# EasyEDA Pro project PID LFR.eprj

# Schematic PCB_SCHEMATIC
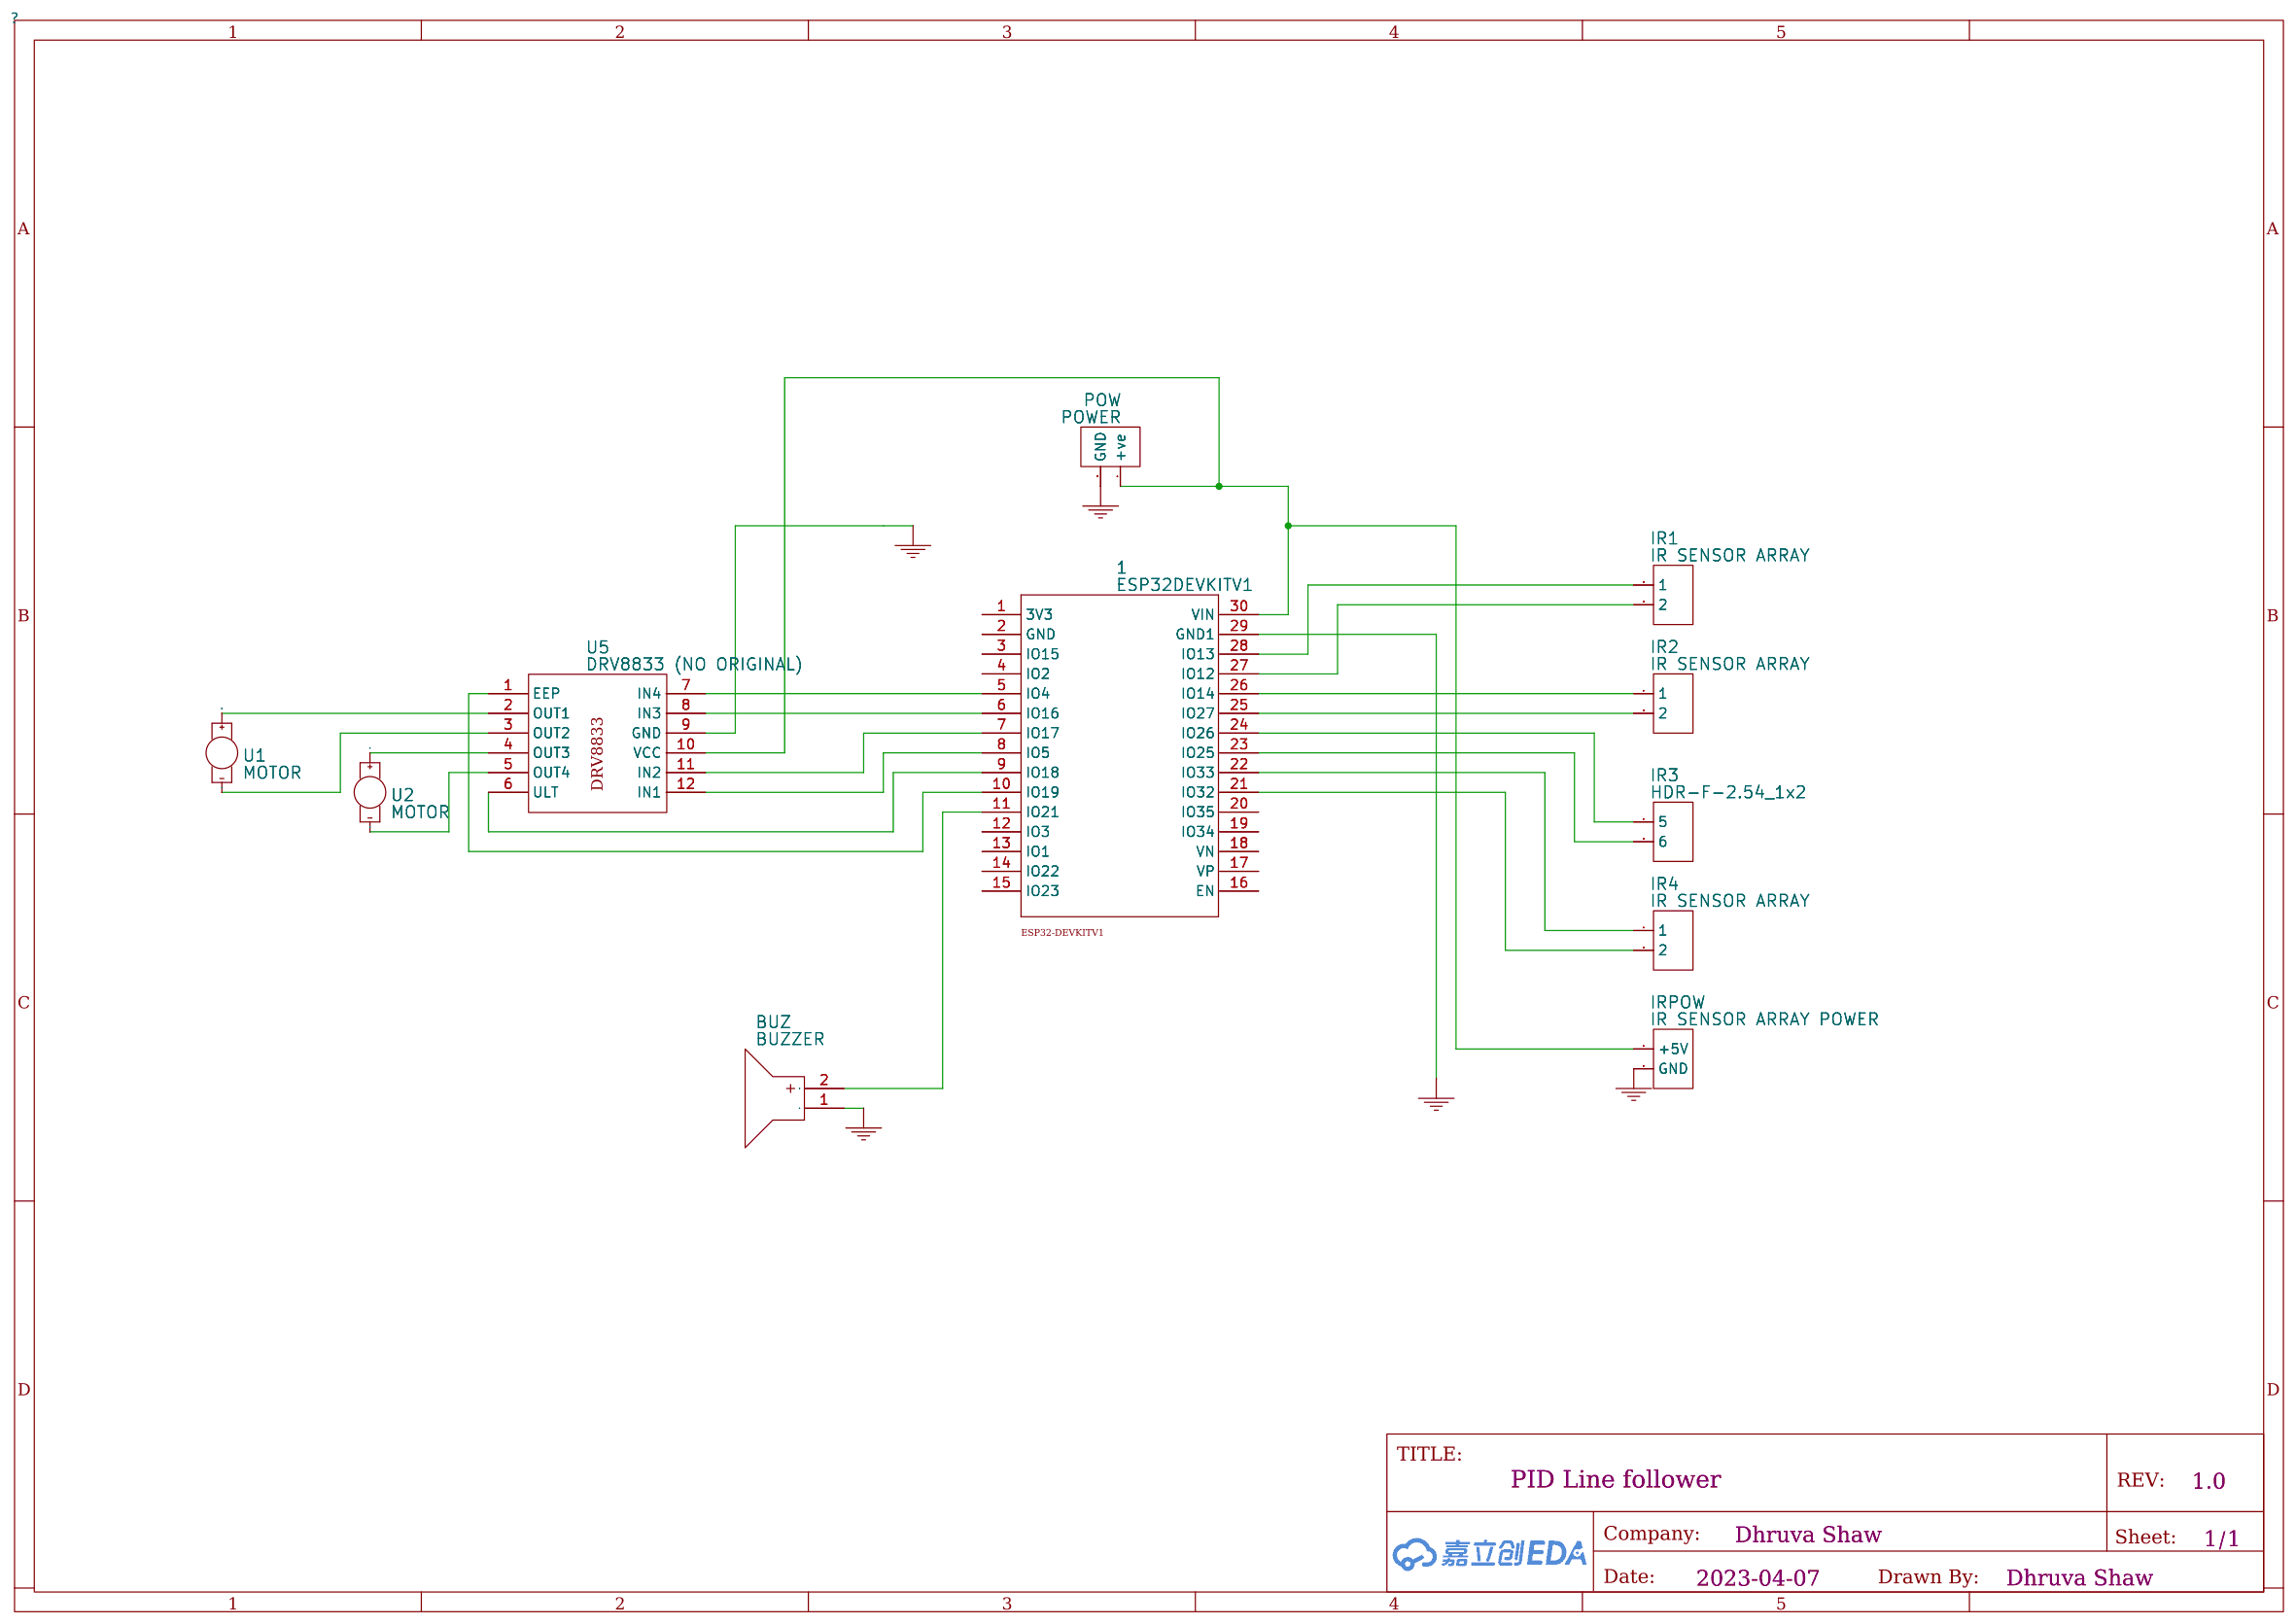
[diagram p0: schematic sheet]

## Parts
1  ESP32DEVKITV1  [ESP32-DEVKITV1]
BUZ  BUZZER  [BUZ-TH_BD12.0-P6.00-D0.9-RD]
IR1  IR SENSOR ARRAY  [HDR-F-2.54_1X2]
IR2  IR SENSOR ARRAY  [HDR-F-2.54_1X2]
IR3  HDR-F-2.54_1x2  [HDR-F-2.54_1X2]
IR4  IR SENSOR ARRAY  [HDR-F-2.54_1X2]
IRPOW  IR SENSOR ARRAY POWER  [HDR-F-2.54_1X2]
POW  POWER  [HDR-F-2.54_1X2]
U1  MOTOR  [VIBE-MOTOR-10MM]
U2  MOTOR  [VIBE-MOTOR-10MM]
U5  DRV8833 (NO ORIGINAL)  [DRV8833 (NO ORIGINAL)]

## Library data of the parts
1 = ESP32DEVKITV1: Supplier: Digi-Key
BUZ = BUZZER: link: https://img.jlc.com/image//data/smt-stock-produce/componentSizePhoto/2022-04-13/30ef8086992546a4800433e601a3dd17/BG2204110731_D22040900139_font.png; Supplier: LCSC; Supplier Part: C9900014030; Manufacturer: null; Manufacturer Part: buzzer; JLCPCB Part Class: Extended Part
IR1 IR2 IR4 = IR SENSOR ARRAY: 3DModel: HDR-F-2.54_1x2; Supplier Part: C49661; Supplier: LCSC
IR3 = HDR-F-2.54_1x2: Supplier Part: C49661; Supplier: LCSC
IRPOW = IR SENSOR ARRAY POWER: 3DModel: HDR-F-2.54_1x2; Supplier Part: C49661; Supplier: LCSC
POW = POWER: 3DModel: HDR-F-2.54_1x2; Supplier Part: C49661; Supplier: LCSC
U1 U2 = MOTOR
U5 = DRV8833 (NO ORIGINAL)

## Nets
GND: 1.29(GND1) BUZ.1(-) IRPOW.2(GND) POW.2(GND) U5.9(GND)
1_5: 1.5(IO4) U5.7(IN4)
1_6: 1.6(IO16) U5.8(IN3)
1_7: 1.7(IO17) U5.11(IN2)
1_8: 1.8(IO5) U5.12(IN1)
1_9: 1.9(IO18) U5.6(ULT)
1_10: 1.10(IO19) U5.1(EEP)
1_11: 1.11(IO21) BUZ.2(+)
1_21: 1.21(IO32) IR4.2(8)
1_22: 1.22(IO33) IR4.1(7)
1_23: 1.23(IO25) IR3.2(6)
1_24: 1.24(IO26) IR3.1(5)
1_25: 1.25(IO27) IR2.2(4)
1_26: 1.26(IO14) IR2.1(3)
1_27: 1.27(IO12) IR1.2
1_28: 1.28(IO13) IR1.1
1_30: 1.30(VIN) IRPOW.1(+5V) POW.1(+ve) U5.10(VCC)
Net-(U1-+): U1.+ U5.2(OUT1)
Net-(U1--): U1.- U5.3(OUT2)
Net-(U2-+): U2.+ U5.4(OUT3)
Net-(U2--): U2.- U5.5(OUT4)

Not connected (* = marked no-connect by the designer): 1 1(3V3) 2(GND) 3(IO15) 4(IO2) 12(IO3) 13(IO1) 14(IO22) 15(IO23) 16(EN) 17(VP) 18(VN) 19(IO34) 20(IO35)

# Schematic ORIGINAL_SCHEMATIC
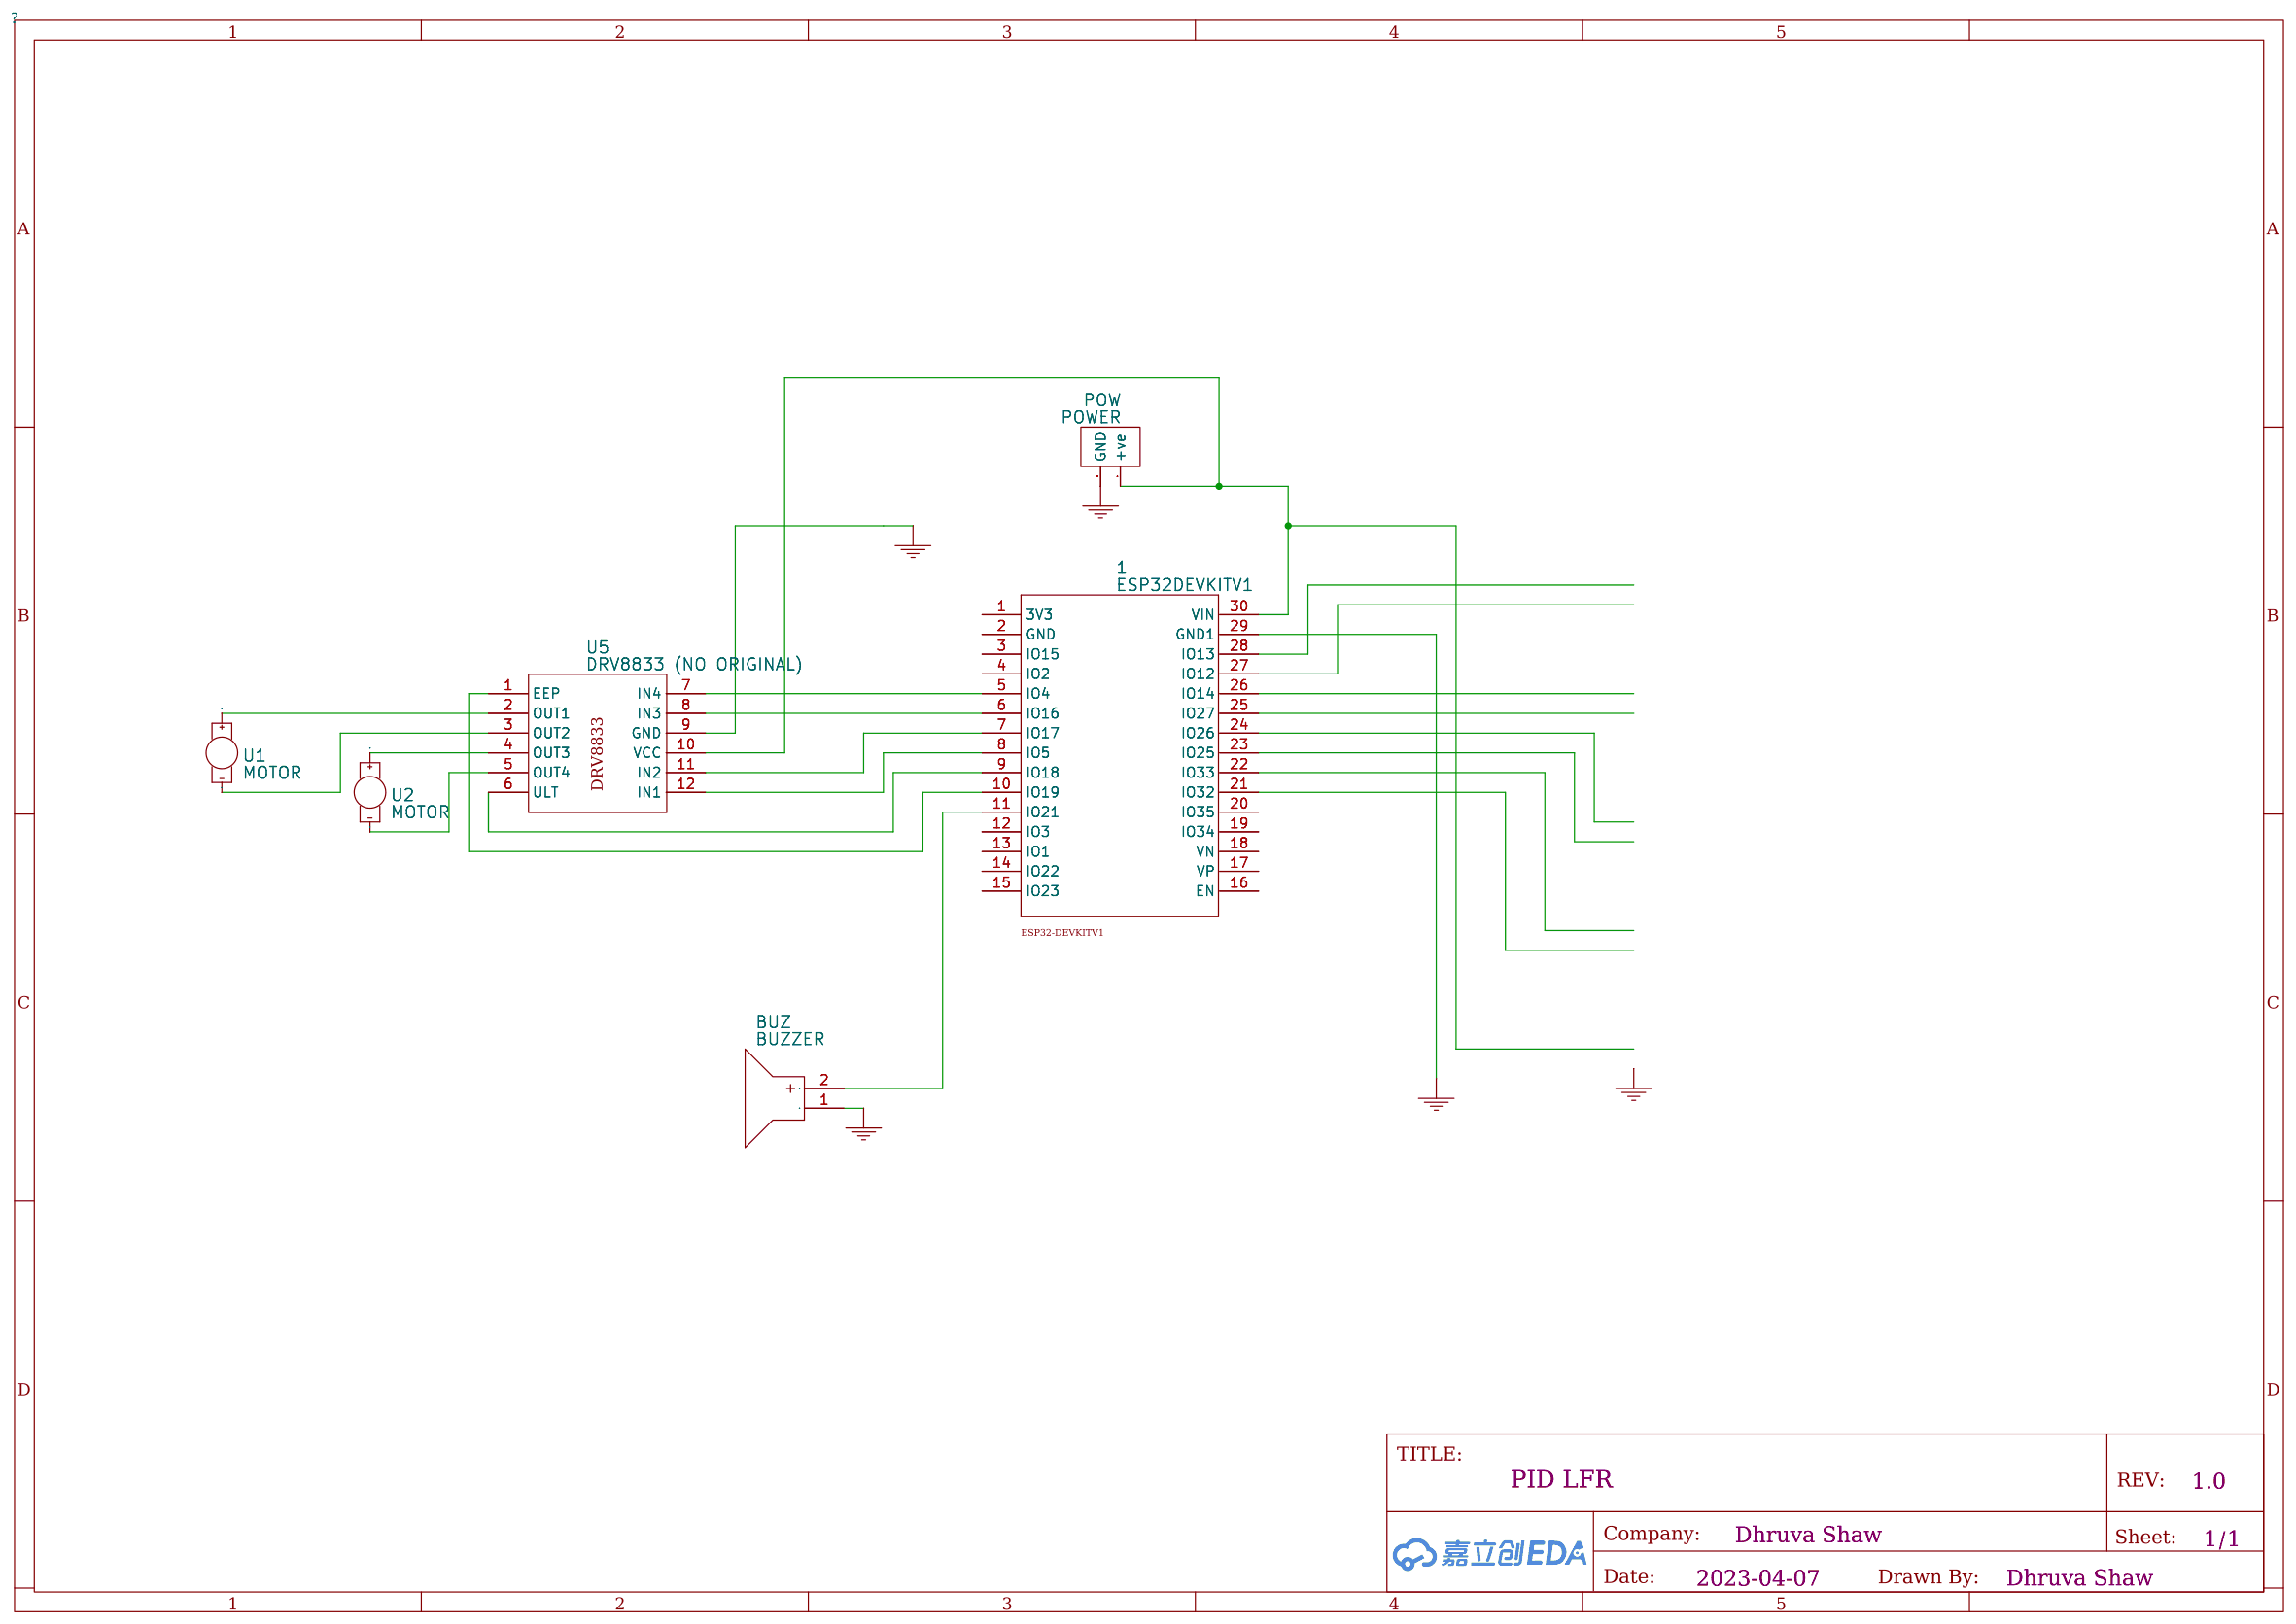
[diagram p1: schematic sheet]

## Parts
1  ESP32DEVKITV1  [ESP32-DEVKITV1]
BUZ  BUZZER  [BUZ-TH_BD12.0-P6.00-D0.9-RD]
POW  POWER  [HDR-F-2.54_1X2]
U1  MOTOR  [VIBE-MOTOR-10MM]
U2  MOTOR  [VIBE-MOTOR-10MM]
U5  DRV8833 (NO ORIGINAL)  [DRV8833 (NO ORIGINAL)]

## Library data of the parts
1 = ESP32DEVKITV1: Supplier: Digi-Key
BUZ = BUZZER: link: https://img.jlc.com/image//data/smt-stock-produce/componentSizePhoto/2022-04-13/30ef8086992546a4800433e601a3dd17/BG2204110731_D22040900139_font.png; Supplier: LCSC; Supplier Part: C9900014030; Manufacturer: null; Manufacturer Part: buzzer; JLCPCB Part Class: Extended Part
POW = POWER: 3DModel: HDR-F-2.54_1x2; Supplier Part: C49661; Supplier: LCSC
U1 U2 = MOTOR
U5 = DRV8833 (NO ORIGINAL)

## Nets
GND: 1.29(GND1) BUZ.1(-) POW.2(GND) U5.9(GND)
Net-(1-5): 1.5(IO4) U5.7(IN4)
Net-(1-6): 1.6(IO16) U5.8(IN3)
Net-(1-7): 1.7(IO17) U5.11(IN2)
Net-(1-8): 1.8(IO5) U5.12(IN1)
Net-(1-9): 1.9(IO18) U5.6(ULT)
Net-(1-10): 1.10(IO19) U5.1(EEP)
Net-(1-11): 1.11(IO21) BUZ.2(+)
Net-(1-30): 1.30(VIN) POW.1(+ve) U5.10(VCC)
Net-(U1-+): U1.+ U5.2(OUT1)
Net-(U1--): U1.- U5.3(OUT2)
Net-(U2-+): U2.+ U5.4(OUT3)
Net-(U2--): U2.- U5.5(OUT4)

Not connected (* = marked no-connect by the designer): 1 1(3V3) 2(GND) 3(IO15) 4(IO2) 12(IO3) 13(IO1) 14(IO22) 15(IO23) 16(EN) 17(VP) 18(VN) 19(IO34) 20(IO35) 21(IO32) 22(IO33) 23(IO25) 24(IO26) 25(IO27) 26(IO14) 27(IO12) 28(IO13)

# Board 1-PCB_PCB_PID LINE FOLLOWER
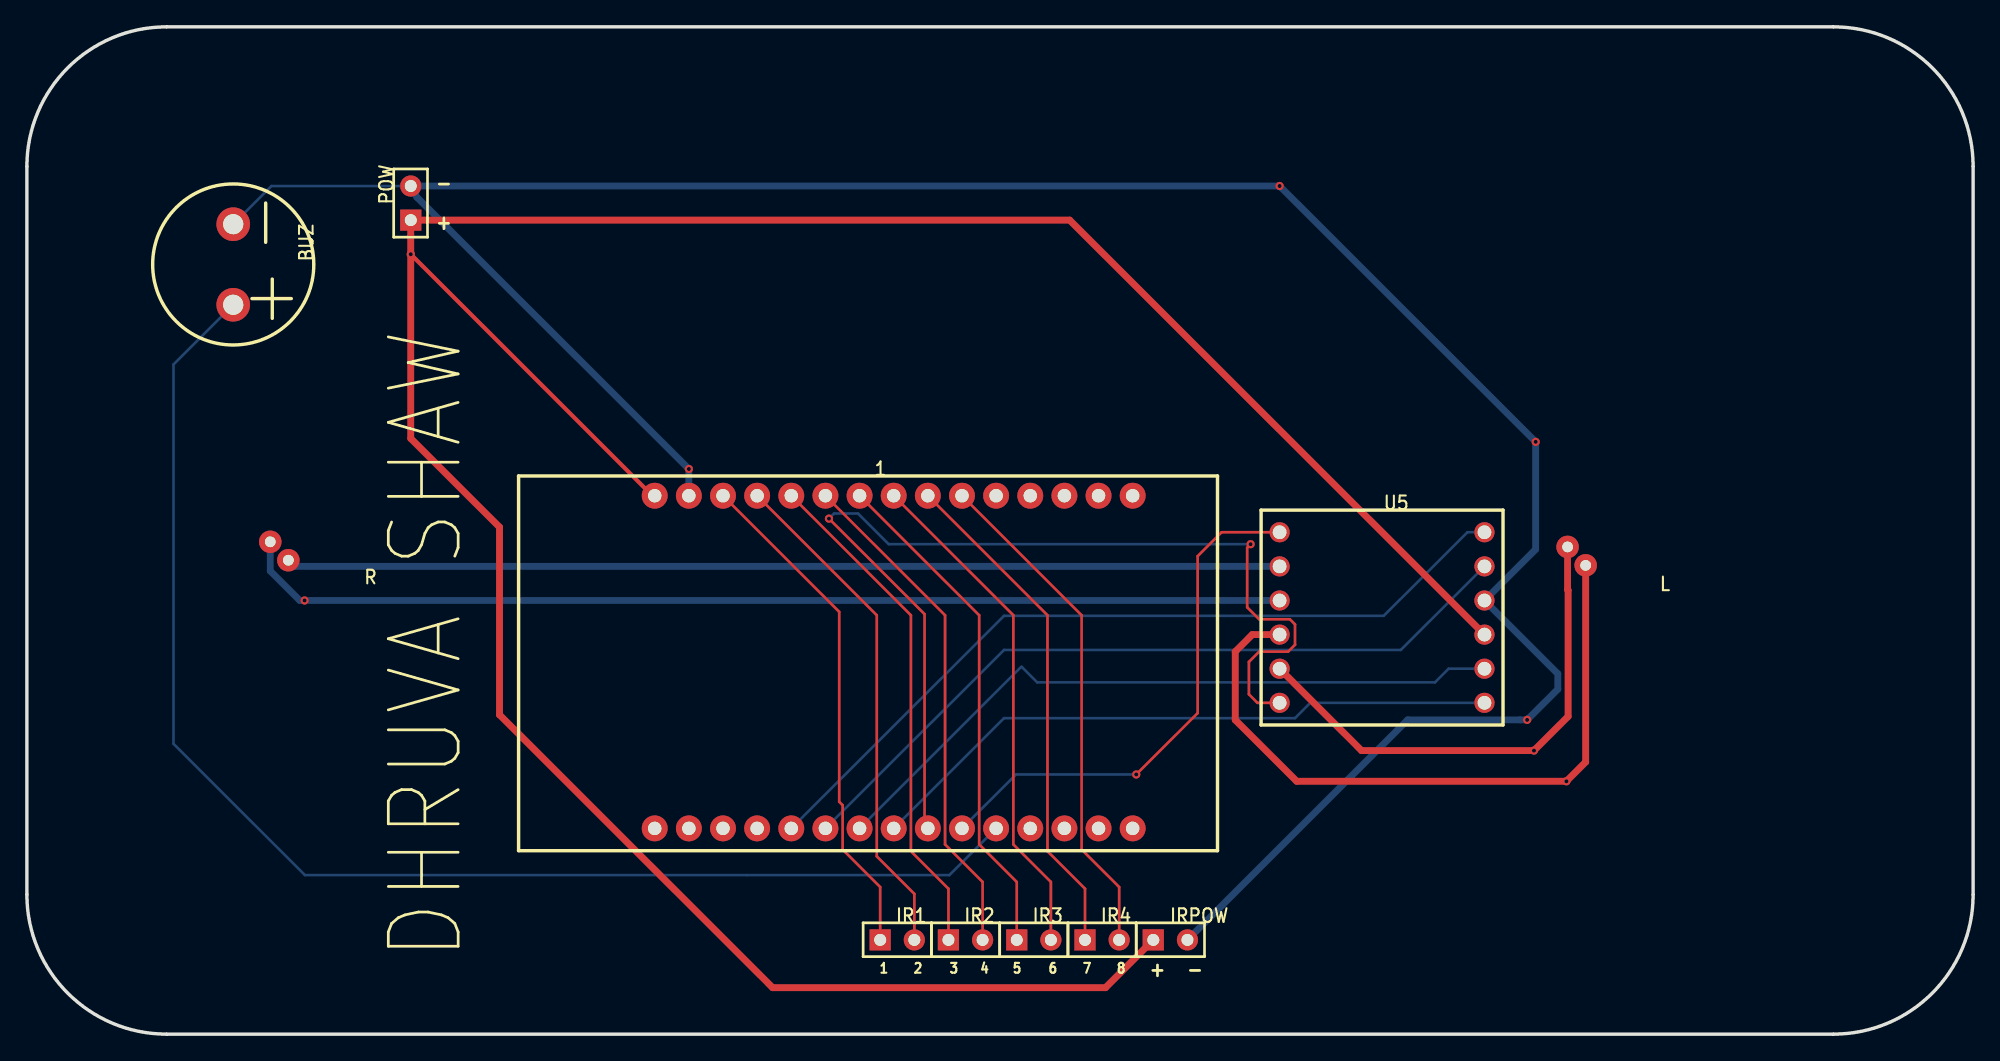
[diagram p2: board, top side]
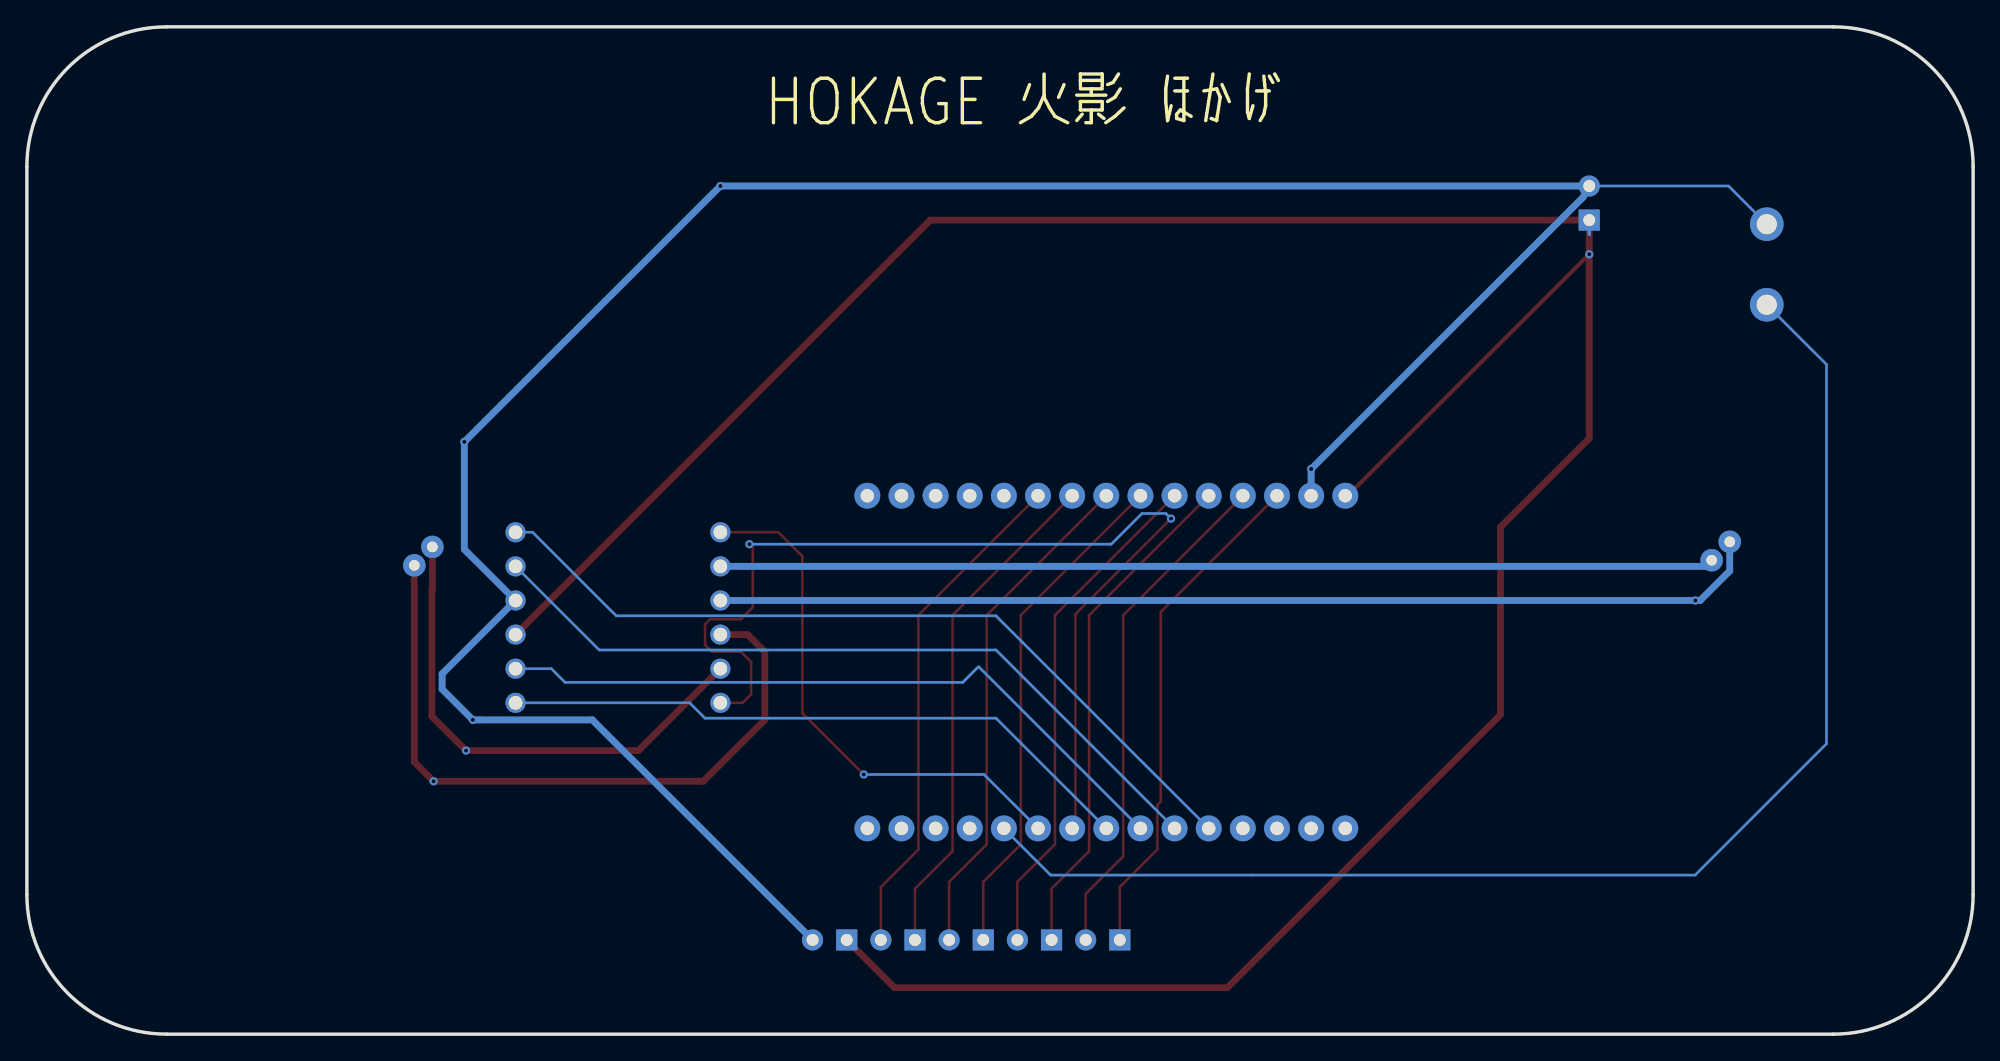
[diagram p3: board, bottom side, seen from below]

Outline 144.8 x 75 mm; copper layers: Top Layer, Inner1, Inner2, Bottom Layer. Coordinates in mm from the lower left corner of the outline.
Outline path: 0,64.6 arc(3.05,71.95) 10.4,75 134.4,75 arc(141.75,71.95) 144.8,64.6 144.8,10.4 arc(141.75,3.05) 134.4,0 10.4,0 arc(3.05,3.05) 0,10.4 0,64.6
Stack: Top Layer 0.035mm / Dielectric1 0.48mm PP er 4.5 / Inner1 0.035mm / Dielectric2 0.48mm FR4 er 4.5 / Inner2 0.035mm / Dielectric3 0.48mm PP er 4.5 / Bottom Layer 0.035mm

## Design rules (mm)
spacing Default (default): track to track 0.152, other pairs 0 to 0.152
track width Default (default): min 0.195, default 0.195, max 25.4
differential pair differentialPair (default): width min 0.127, default 0.254, max 2.54; gap min 0.152, default 0.152
via Default (default): diameter min 0.61, default 0.61, max 100.025; hole min 0.305, default 0.305, max 59.995

## Placement (name value [footprint] x y rotation side)
1  ESP32DEVKITV1  [ESP32-DEVKITV1]  69.58 28.86 0 top
BUZ  BUZZER  [BUZ-TH_BD12.0-P6.00-D0.9-RD]  15.35 57.31 270 top
IR1  IR SENSOR ARRAY  [HDR-F-2.54_1X2]  64.75 7.02 0 top
IR2  IR SENSOR ARRAY  [HDR-F-2.54_1X2]  69.84 7.02 0 top
IR3  HDR-F-2.54_1x2  [HDR-F-2.54_1X2]  74.91 7.02 0 top
IR4  IR SENSOR ARRAY  [HDR-F-2.54_1X2]  80 7.02 0 top
IRPOW  IR SENSOR ARRAY POWER  [HDR-F-2.54_1X2]  85.07 7.02 0 top
L  MOTOR  [VIBE-MOTOR-10MM]  115.3 35.59 0 top
POW  POWER  [HDR-F-2.54_1X2]  28.56 61.88 90 top
R  MOTOR  [VIBE-MOTOR-10MM]  18.78 35.97 0 top
U5  -  [DRV8833 (NO ORIGINAL)]  100.82 31.02 0 top

## Footprints (pads in the part's own frame, mm; a bottom-side part is the same pattern mirrored in y, then rotated)
BUZ-TH_BD12.0-P6.00-D0.9-RD
  round 2.5 hole 1.5: 1(-3,0) 2(3,0)
DRV8833 (NO ORIGINAL)
  round 1.5 hole 1.02: 1(-7.62,6.35) 2(-7.62,3.81) 3(-7.62,1.27) 4(-7.62,-1.27) 5(-7.62,-3.81) 6(-7.62,-6.35) 7(7.62,6.35) 8(7.62,3.81) 9(7.62,1.27) 10(7.62,-1.27) 11(7.62,-3.81) 12(7.62,-6.35)
ESP32-DEVKITV1
  round 1.931 hole 1x1: 1(-22.87,-13.54) 2(-20.33,-13.54) 3(-17.79,-13.54) 4(-15.25,-13.54) 5(-12.71,-13.54) 6(-10.17,-13.54) 7(-7.63,-13.54) 8(-5.09,-13.54) 9(-2.55,-13.54) 10(-0.01,-13.54) 11(2.53,-13.54) 12(5.07,-13.54) 13(7.61,-13.54) 14(10.15,-13.54) 15(12.69,-13.54) 16(12.69,11.23) 17(10.15,11.23) 18(7.61,11.23) 19(5.07,11.23) 20(2.53,11.23) 21(-0.01,11.23) 22(-2.55,11.23) 23(-5.09,11.23) 24(-7.63,11.23) 25(-10.17,11.23) 26(-12.71,11.23) 27(-15.25,11.23) 28(-17.79,11.23) 29(-20.33,11.23) 30(-22.87,11.23)
HDR-F-2.54_1X2
  rect 1.575x1.575 hole 0.889: 1(-1.27,0)
  round 1.575 hole 0.889: 2(1.27,0)
VIBE-MOTOR-10MM
  round 1.677 hole 0.797: +(0.673,-0.686) -(-0.673,0.686)

## Nets
As in the schematic, except:
U1_+: R.+ U5.2
U1_-: R.- U5.3
U2_+: L.+ U5.4
U2_-: L.- U5.5

## Via types
v1: diameter 0.61, hole 0.305, Top Layer to Bottom Layer, 11 vias

## Routing (per net, layer and track width the routed paths; a pad name or vN(x,y) marks a point on that pad's centre or on a via; arc(x,y) is an arc through that point)
GND: length 195.1
  Bottom Layer w0.195: BUZ.1 18.19,63.15 POW.2
  Bottom Layer w0.508: IRPOW.2 102.73,23.4 v1(111.62,23.4) 113.9,25.69 113.9,26.83 U5.9 112.25,36.1 v1(112.25,44.1) v1(93.2,63.15) POW.2 29.02,62.31 v1(49.25,42.08) 49.25,40.09
1_5: length 60.7
  Bottom Layer w0.195: 56.87,15.32 72.7,31.15 100.95,31.15 107.17,37.37 U5.7
1_6: length 57.1
  Bottom Layer w0.195: 108.44,34.83 102.22,28.61 72.7,28.61 1.6
1_7: length 52.4
  Bottom Layer w0.195: 1.7 73.97,27.34 74.03,27.34 75.17,26.19 104.76,26.19 105.78,27.21 U5.11
1_8: length 47.8
  Bottom Layer w0.195: 108.44,24.67 95.49,24.67 94.35,23.53 72.7,23.53 1.8
1_9: length 77.9
  Top Layer w0.195: 93.2,24.67 91.55,24.67 90.92,25.3 90.92,27.72 91.68,28.48 93.84,28.48 94.35,28.99 94.35,30.51 93.97,30.89 91.68,30.89 90.79,31.78 90.79,36.23 v1(91.04,36.48) ; v1(59.68,38.39) 66.79,31.27 66.79,15.56 67.03,15.32
  Bottom Layer w0.195: v1(59.68,38.39) 60.06,38.77 61.83,38.77 64.12,36.48 v1(91.04,36.48)
1_10: length 39.6
  Top Layer w0.195: U5.1 88.88,37.37 87.11,35.59 87.11,23.91 v1(82.53,19.33)
  Bottom Layer w0.195: v1(82.53,19.33) 73.59,19.33 1.10
1_11: length 101.2
  Bottom Layer w0.195: 1.11 68.63,11.84 20.69,11.84 10.91,21.62 10.91,49.86 BUZ.2
1_21: length 37.9
  Top Layer w0.195: 1.21 78.47,31.19 78.47,13.75 81.26,10.95 81.26,7.02
1_22: length 39
  Top Layer w0.195: 67.03,40.09 75.93,31.19 75.93,13.62 78.72,10.83 IR4.1
  Inner2 w0.254: IR4.1 78.72,8.08
1_23: length 37.9
  Top Layer w0.195: IR3.2 76.19,11.33 73.39,14.13 73.39,31.19 1.23
1_24: length 39
  Top Layer w0.195: IR3.1 73.65,11.33 70.85,14.13 70.85,31.19 1.24
  Inner2 w0.254: IR3.1 73.65,8.08
1_25: length 37.9
  Top Layer w0.195: 71.1,7.02 71.1,11.33 68.31,14.13 68.31,31.19 1.25
1_26: length 37.9
  Top Layer w0.195: IR2.1 68.56,10.83 65.77,13.62 65.77,31.19 56.87,40.09
1_27: length 37.9
  Top Layer w0.195: 1.27 63.23,31.19 63.23,13.24 66.03,10.44 IR1.2
1_28: length 37.9
  Top Layer w0.195: IR1.1 63.49,10.95 60.69,13.75 60.69,17.05 60.44,17.3 60.44,31.44 1.28
1_30: length 220
  Top Layer w0.304: 46.71,40.09 46.54,40.09 v1(28.56,58.07) POW.1
  Top Layer w0.508: IRPOW.1 80.25,3.46 55.48,3.46 35.16,23.78 35.16,37.75 28.56,44.35 v1(28.56,58.07) POW.1 77.58,60.61 108.44,29.75
  Bottom Layer w0.254: POW.1 28.56,59.54
U1_+: length 73.9
  Bottom Layer w0.508: 93.2,34.83 19.91,34.83 R.+
U1_-: length 78.2
  Bottom Layer w0.508: R.- 18.11,34.49 20.31,32.29 v1(20.66,32.29) U5.3
U2_+: length 52.1
  Top Layer w0.508: 93.2,29.75 91.17,29.75 89.9,28.48 89.9,23.4 94.47,18.83 v1(114.54,18.83) 115.97,20.26 L.+
U2_-: length 37.7
  Top Layer w0.508: U5.5 99.3,21.11 v1(112.13,21.11) 114.67,23.65 114.67,33.05 114.63,33.09 L.-

## Text on the board
Bottom Silkscreen Layer: HOKAGE 火影 ほかげ
Top Silkscreen Layer: 1 | 2 | 3 | 4 | 5 | 6 | 7 | 8 | - | + | DHRUVA SHAW
